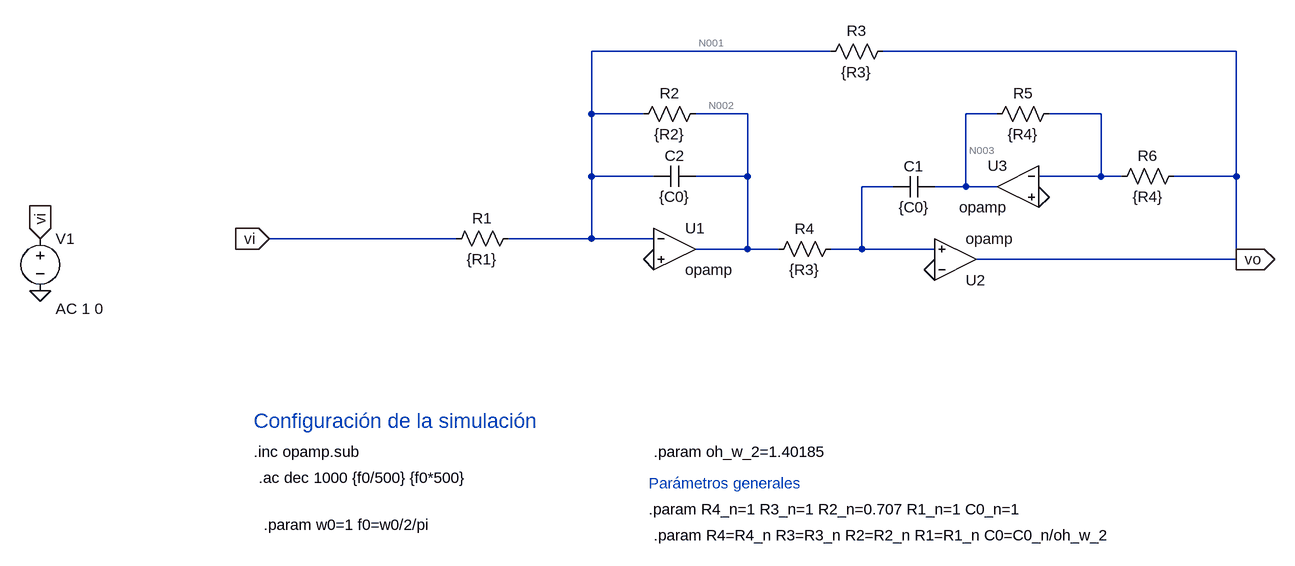
[diagram p0: schematic ack_moss_bicuad.asc]
ack_moss_bicuad.asc, the LTspice schematic file:
Version 4
SHEET 1 2172 1280
WIRE 384 -48 16 -48
WIRE 1008 -48 464 -48
WIRE 16 48 16 -48
WIRE 96 48 16 48
WIRE 256 48 176 48
WIRE 640 48 592 48
WIRE 800 48 720 48
WIRE 16 144 16 48
WIRE 112 144 16 144
WIRE 256 144 256 48
WIRE 256 144 176 144
WIRE 800 144 800 48
WIRE 800 144 704 144
WIRE 832 144 800 144
WIRE 1008 144 1008 -48
WIRE 1008 144 912 144
WIRE 480 160 432 160
WIRE 592 160 592 48
WIRE 592 160 544 160
WIRE 640 160 592 160
WIRE -192 240 -480 240
WIRE 16 240 16 144
WIRE 16 240 -112 240
WIRE 112 240 16 240
WIRE 256 256 256 144
WIRE 256 256 176 256
WIRE 304 256 256 256
WIRE 432 256 432 160
WIRE 432 256 384 256
WIRE 544 256 432 256
WIRE 1008 272 1008 144
WIRE 1008 272 608 272
FLAG 544 288 0
FLAG 112 272 0
FLAG 704 176 0
FLAG 1008 272 vo
IOPIN 1008 272 Out
FLAG -480 240 vi
IOPIN -480 240 In
FLAG -832 320 0
FLAG -832 240 vi
IOPIN -832 240 In
SYMBOL res -96 224 R90
WINDOW 0 0 56 VBottom 2
WINDOW 3 32 56 VTop 2
SYMATTR InstName R1
SYMATTR Value {R1}
SYMBOL res 192 32 R90
WINDOW 0 0 56 VBottom 2
WINDOW 3 32 56 VTop 2
SYMATTR InstName R2
SYMATTR Value {R2}
SYMBOL res 480 -64 R90
WINDOW 0 0 56 VBottom 2
WINDOW 3 32 56 VTop 2
SYMATTR InstName R3
SYMATTR Value {R3}
SYMBOL res 400 240 R90
WINDOW 0 0 56 VBottom 2
WINDOW 3 32 56 VTop 2
SYMATTR InstName R4
SYMATTR Value {R3}
SYMBOL res 736 32 R90
WINDOW 0 0 56 VBottom 2
WINDOW 3 32 56 VTop 2
SYMATTR InstName R5
SYMATTR Value {R4}
SYMBOL res 928 128 R90
WINDOW 0 0 56 VBottom 2
WINDOW 3 32 56 VTop 2
SYMATTR InstName R6
SYMATTR Value {R4}
SYMBOL cap 544 144 R90
WINDOW 0 0 32 VBottom 2
WINDOW 3 32 32 VTop 2
SYMATTR InstName C1
SYMATTR Value {C0}
SYMBOL cap 176 128 R90
WINDOW 0 0 32 VBottom 2
WINDOW 3 32 32 VTop 2
SYMATTR InstName C2
SYMATTR Value {C0}
SYMBOL OpAmps\\opamp 144 192 R0
SYMATTR InstName U1
SYMBOL OpAmps\\opamp 576 336 M180
SYMATTR InstName U2
SYMBOL OpAmps\\opamp 672 96 M0
SYMATTR InstName U3
SYMBOL voltage -832 224 R0
WINDOW 123 24 124 Left 2
WINDOW 39 0 0 Left 0
SYMATTR Value2 AC 1 0
SYMATTR InstName V1
SYMATTR Value ""
TEXT -504 568 Left 2 !.inc opamp.sub
TEXT -496 608 Left 2 !.ac dec 1000 {f0/500} {f0*500}
TEXT -504 520 Left 3 ;Configuración de la simulación
TEXT 104 616 Left 2 ;Parámetros generales
TEXT 104 656 Left 2 !.param R4_n=1 R3_n=1 R2_n=0.707 R1_n=1 C0_n=1
TEXT -488 680 Left 2 !.param w0=1 f0=w0/2/pi
TEXT 112 696 Left 2 !.param R4=R4_n R3=R3_n R2=R2_n R1=R1_n C0=C0_n/oh_w_2
TEXT 112 568 Left 2 !.param oh_w_2=1.40185

The netlist it stands for:
* ack_moss_bicuad.asc
R1 N001 vi {R1}
R2 N002 N001 {R2}
R3 vo N001 {R3}
R4 N005 N002 {R3}
R5 N004 N003 {R4}
R6 vo N004 {R4}
C1 N003 N005 {C0}
C2 N002 N001 {C0}
XU1 N001 0 N002 opamp Aol=100K GBW=10Meg  ; pins invin noninvin out
XU2 0 N005 vo opamp Aol=100K GBW=10Meg  ; pins invin noninvin out
XU3 N004 0 N003 opamp Aol=100K GBW=10Meg  ; pins invin noninvin out
V1 vi 0 AC 1 0
.inc opamp.sub
.ac dec 1000 {f0/500} {f0*500}
* Configuración de la simulación
* Parámetros generales
.param R4_n=1 R3_n=1 R2_n=0.707 R1_n=1 C0_n=1
.param w0=1 f0=w0/2/pi
.param R4=R4_n R3=R3_n R2=R2_n R1=R1_n C0=C0_n/oh_w_2
.param oh_w_2=1.40185
.backanno
.end

* Results of the author's LTspice run, read from the files saved beside the schematic
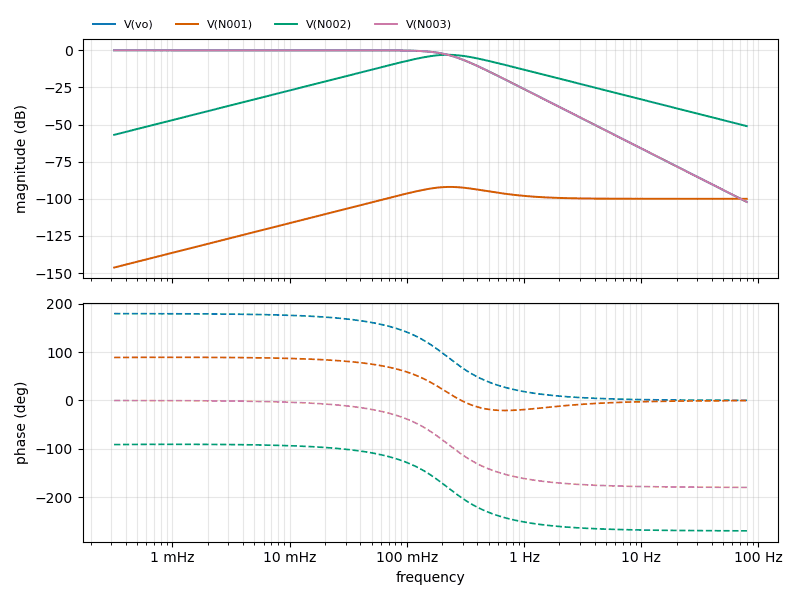
[diagram p1: AC Analysis of ack_moss_bicuad.asc, plotted from the saved traces]
* AC Analysis, 1 run:
*   V(vo): -0.00 dB at 318.3 µHz, -102.09 dB at 79.58 Hz, peak -0.00 dB at 318.3 µHz, 3 dB below the peak at 223.1 mHz
*   V(N001): -146.25 dB at 318.3 µHz, -99.98 dB at 79.58 Hz, peak -91.97 dB at 232.7 mHz, 3 dB below the peak at 119.7 mHz and 503 mHz
*   V(N002): -56.91 dB at 318.3 µHz, -51.05 dB at 79.58 Hz, peak -3.01 dB at 223.3 mHz, 3 dB below the peak at 115.5 mHz and 431.1 mHz
*   V(N003): -0.00 dB at 318.3 µHz, -102.09 dB at 79.58 Hz, peak -0.00 dB at 318.3 µHz, 3 dB below the peak at 223.1 mHz